# Altium schematic sheet edison_misc.SchDoc: Edison Breakout
size Letter; Author: Ye-Sheng Kuo; Revision: 1; SheetTotal: 9
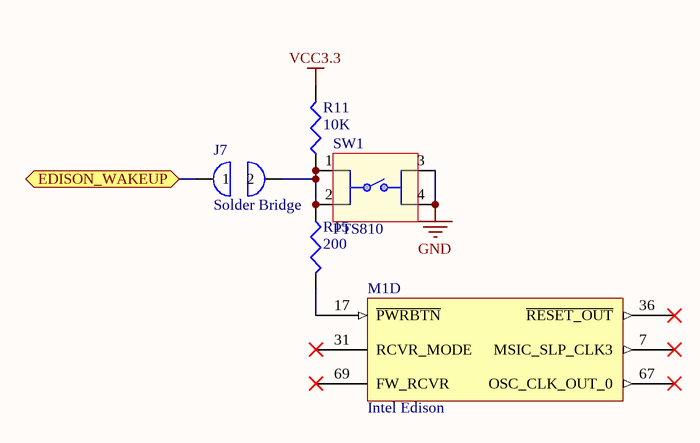
[diagram p0: edison_misc.SchDoc]

## Parts
J7  Solder Bridge  [SolderBridge]
M1  Intel Edison  [Intel Edison mating]  (part D of 5)
R11  value 10K  [0402]  (hidden comment: Chip resistor)
R15  value 200  [0402]  (hidden comment: Chip resistor)
SW1  PTS810  [PTS810]

## Ports
EDISON_WAKEUP

## Nets
GND: SW1.3 SW1.4
VCC3.3: R11.1
EDISON_WAKEUP: J7.1 ; port EDISON_WAKEUP
NetJ7_2: J7.2 R11.2 R15.2 SW1.1 SW1.2
NetM1_17: M1.17(~{PWRBTN}) R15.1

Not connected (* = marked no-connect by the designer): M1 7(MSIC_SLP_CLK3)* 31(RCVR_MODE)* 36(~{RESET_OUT})* 67(OSC_CLK_OUT_0)* 69(FW_RCVR)*

## Notes on the sheet
- Title
- Date:
- Author:
- Revision:
- Sheet
- of
- University of Michigan
- File:

## Library data of the parts
J7 = SolderBridge
R11 = R_10K_0402: Chip resistor, 10K, 0402 package; tolerance: 1%; power: 1/16 W; package: 0402; Supplier 1: Digi-Key; Supplier Part Number 1: 541-10.0KLCT-ND
R15 = R_200_0402: Chip resistor, 200, 0402 package; tolerance: 1%; power: 1/16 W; package: 0402; Supplier 1: Digi-Key; Supplier Part Number 1: 541-200LCT-ND
SW1 = PTS810: Tactile Switches; Supplier 1: Digi-Key; Supplier Part Number 1: CKN10504CT-ND